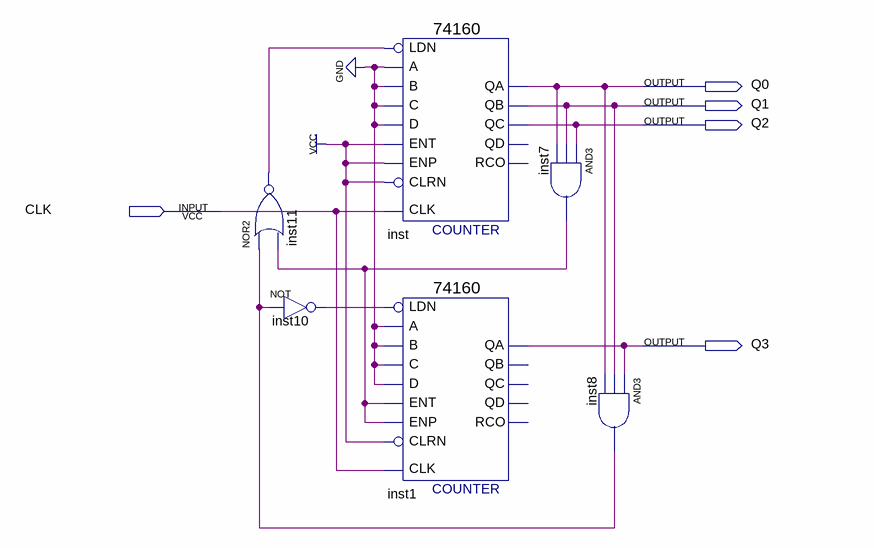
[diagram p0: schematic sheet]
// Quartus schematic lab7.bdf as structural Verilog: 6 symbols, 5 pins
module lab7 (
  input  CLK,
  output Q0,
  output Q1,
  output Q2,
  output Q3
);

  wire inst7_out, inst8_out, inst10_out, inst11_out;

  nor inst11 (inst11_out, inst8_out, inst7_out);
  not inst10 (inst10_out, inst8_out);
  \74160  inst (
    .CLK(CLK), .ENT(1'b1), .A(1'b0), .B(1'b0), .C(1'b0), .D(1'b0), .LDN(inst11_out), .ENP(1'b1), .CLRN(1'b1),
    .QA(Q0), .QB(Q1), .QC(Q2));  // open: QD, RCO
  \74160  inst1 (
    .CLK(CLK), .ENT(inst7_out), .A(1'b0), .B(1'b0), .C(1'b0), .D(1'b0), .LDN(inst10_out), .ENP(inst7_out),
    .CLRN(1'b1), .QA(Q3));  // open: QD, QB, QC, RCO
  and inst7 (inst7_out, Q2, Q1, Q0);
  and inst8 (inst8_out, Q3, Q1, Q0);
endmodule
